# EAGLE design Heating Controller (EAGLE 6.4)
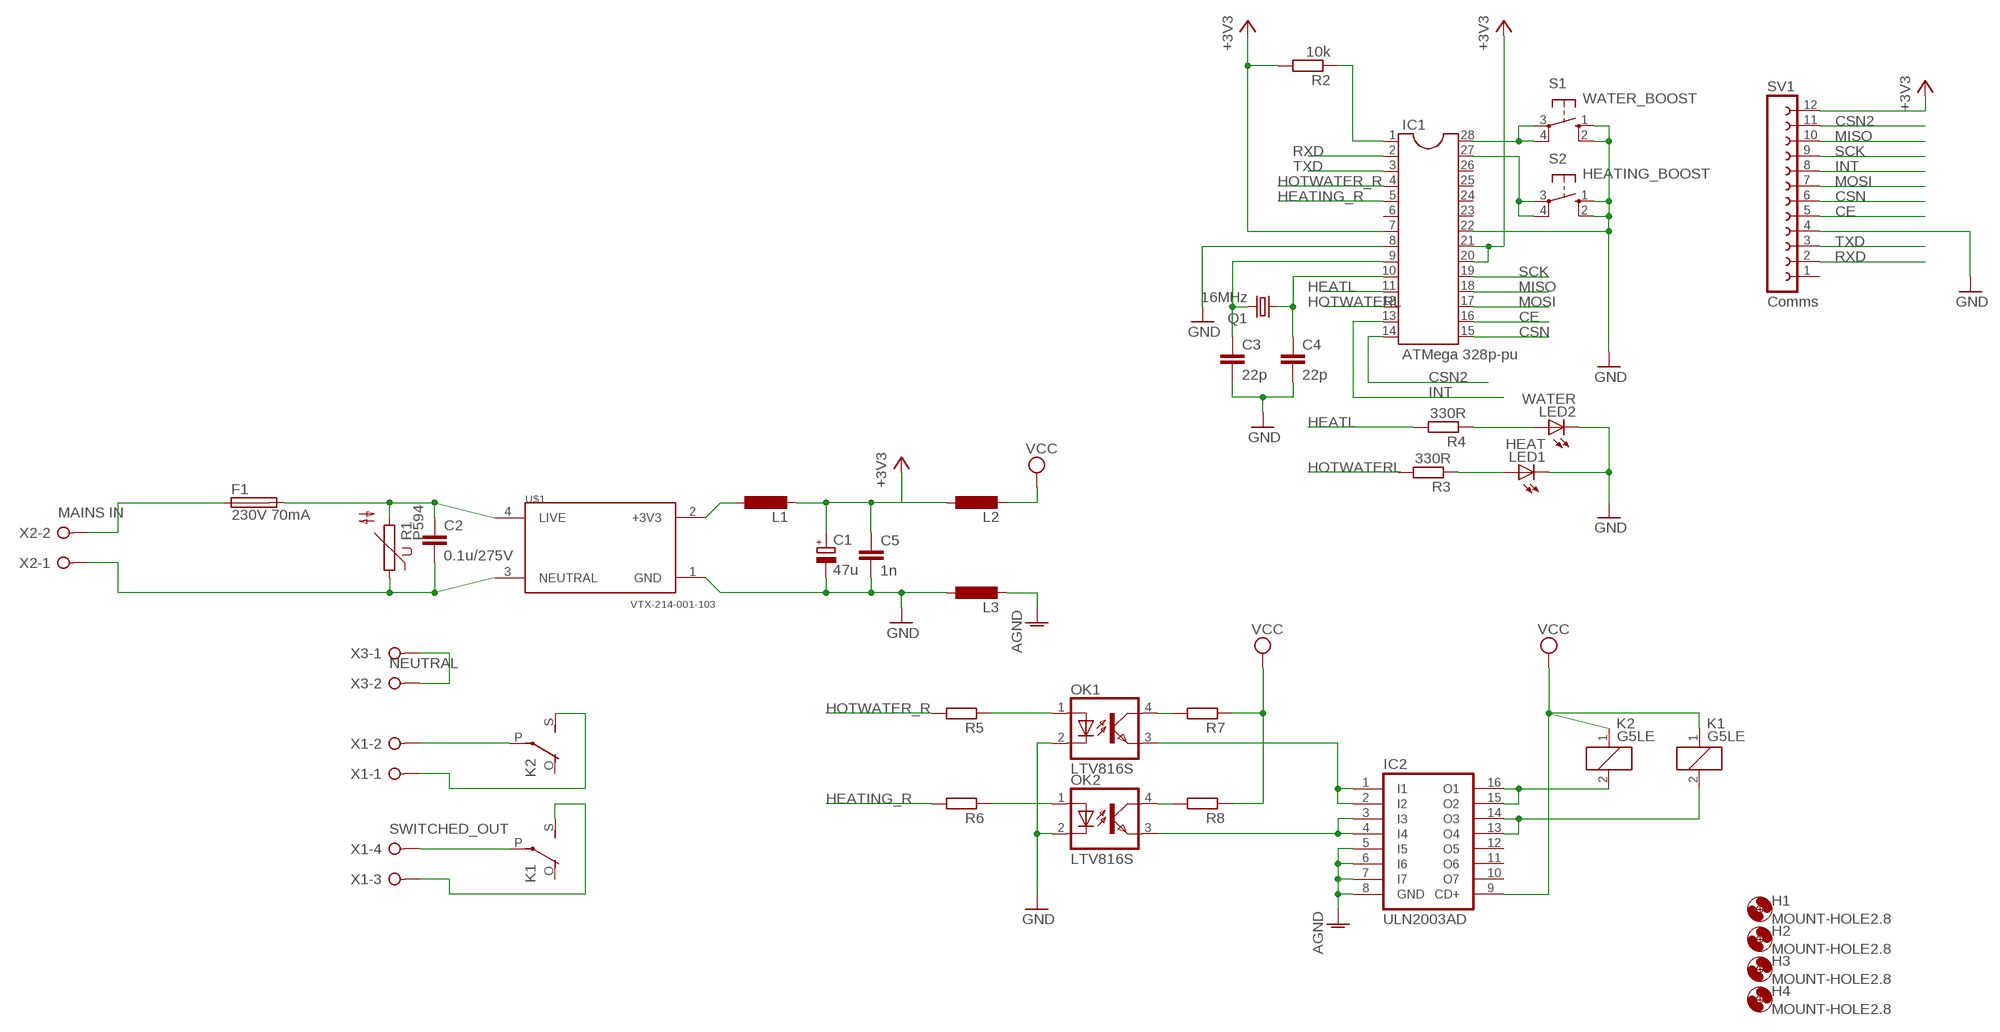
[diagram p0: schematic, sheet 1]

## Parts
C1  47u  CPOL-EUE2.5-7  [E2,5-7]
C2  0.1u/275V  C15/5  [C15B5]
C3  22p  C-EUC1206K  [C1206K]
C4  22p  C-EUC1206K  [C1206K]
C5  1n  C-EUC1206K  [C1206K]
F1  230V 70mA  SH22,5A  [SH22,5A]
H1  MOUNT-HOLE2.8  [2,8]
H2  MOUNT-HOLE2.8  [2,8]
H3  MOUNT-HOLE2.8  [2,8]
H4  MOUNT-HOLE2.8  [2,8]
IC1  ATMega 328p-pu  DIL28-3  [DIL28-3]
IC2  ULN2003AD  [SO16]
K1  G5LE  [G5LE]
K2  G5LE  [G5LE]
L1  L-EUL3230M  [L3230M]
L2  L-EUL3230M  [L3230M]
L3  L-EUL3230M  [L3230M]
LED1  HEAT  LED5MM  [LED5MM]
LED2  WATER  LED5MM  [LED5MM]
OK1  LTV816S  [SMD4]
OK2  LTV816S  [SMD4]
Q1  16MHz  CRYSTALHC49S  [HC49/S]
R1  P594  [P594]
R2  10k  R-EU_R1206  [R1206]
R3  330R  R-EU_R1206  [R1206]
R4  330R  R-EU_R1206  [R1206]
R5  R-EU_R1206  [R1206]
R6  R-EU_R1206  [R1206]
R7  R-EU_R1206  [R1206]
R8  R-EU_R1206  [R1206]
S1  WATER_BOOST  40-XX  [B3F-40XX]
S2  HEATING_BOOST  40-XX  [B3F-40XX]
SV1  Comms  FE12W  [FE12W]
U$1  VTX-214-001-103  [VTX214001103]
X1  SWITCHED_OUT  W237-04P  [W237-4P]
X2  MAINS IN  W237-02P  [W237-132]
X3  NEUTRAL  W237-02P  [W237-132]

## Nets
+3V3: C1.+ C5.1 IC1.7 IC1.20 IC1.21 L1.2 L2.1 R2.2 SV1.12
+3V3A: L1.1 U$1.2(+3V3)
AGND: IC2.5(I5) IC2.6(I6) IC2.7(I7) IC2.8(GND) L3.2
CE: IC1.16 SV1.5
CSN: IC1.15 SV1.6
CSN2: IC1.14 SV1.11
GND: C1.- C3.2 C4.2 C5.2 IC1.8 IC1.22 L3.1 LED1.K(C) LED2.K(C) OK1.2(C) OK2.2(C) S1.1(S) S1.2(S1) S2.1(S) S2.2(S1) SV1.4 U$1.1(GND)
HEATING_R: IC1.5 R6.2
HEATL: IC1.11 R4.2
HOTWATER_R: IC1.4 R5.2
HOTWATERL: IC1.12 R3.2
INT: IC1.13 SV1.8
MISO: IC1.18 SV1.10
MOSI: IC1.17 SV1.7
N$1: F1.1 X2.2
N$2: C2.1 F1.2 R1.2 U$1.4(LIVE)
N$3: C2.2 R1.1 U$1.3(NEUTRAL) X2.1
N$4: IC1.1 R2.1
N$5: C3.1 IC1.9 Q1.2
N$6: C4.1 IC1.10 Q1.1
N$7: LED1.A R3.1
N$8: LED2.A R4.1
N$9: IC1.28 S1.3(P) S1.4(P1)
N$10: IC1.27 S2.3(P) S2.4(P1)
N$11: OK1.1(A) R5.1
N$12: IC2.15(O2) IC2.16(O1) K2.2
N$13: IC2.13(O4) IC2.14(O3) K1.2
N$14: OK2.1(A) R6.1
N$15: K2.P(2:P) X1.2
N$16: K2.S(2:S) X1.1
N$17: K1.P(2:P) X1.4
N$18: K1.S(2:S) X1.3
N$19: X3.1 X3.2
N$20: OK1.4(COL) R7.2
N$21: OK2.4(COL) R8.2
N$22: IC2.1(I1) IC2.2(I2) OK1.3(EMIT)
N$23: IC2.3(I3) IC2.4(I4) OK2.3(EMIT)
RXD: IC1.2 SV1.2
SCK: IC1.19 SV1.9
TXD: IC1.3 SV1.3
VCC: IC2.9(CD+) K1.1 K2.1 L2.2 R7.1 R8.1
Unconnected: IC1.6 IC1.23 IC1.24 IC1.25 IC1.26 IC2.10(O7) IC2.11(O6) IC2.12(O5) K1.O(2:O) K2.O(2:O) SV1.1

## Library data of the parts
C1 = resistor:CPOL-EU: POLARIZED CAPACITOR, European symbol
C2 = capacitor-wima:C: CAPACITOR naming: grid - package width
C3-C5 = rcl:C-EU: CAPACITOR, European symbol
F1 = fuse:SH22,5A: FUSE HOLDER grid 22,5mm, isolated cap OGN0031 8201, Schurter (Buerklin); MPN: 0031.7701.11; OC_FARNELL: unknown; OC_NEWARK: 04F1224
H1-H4 = holes:MOUNT-HOLE: MOUNTING HOLE with drill center marker
IC1 = ic-package:DIL28: Dual In Line
IC2 = uln-udn:ULN2003A: DRIVER ARRAY
K1 K2 = relay:G5LE: RELAY 1 x switch, 10 A/120 V AC, 8 A/30 V DC, Omron; OC_FARNELL: unknown; OC_NEWARK: unknown
L1-L3 = rcl:L-EU: INDUCTOR, European symbol
LED1 LED2 = led:LED: LED OSRAM: - CHIPLED LG R971, LG N971, LY N971, LG Q971, LY Q971, LO R971, LY R971 LH N974, LH R974 LS Q976, LO Q976, LY Q976 LO Q996 - Hyper CHIPLED LW Q18S LB Q993, LB Q99A, LB R99A - SideLED LS A670, LO A670, LY A670, LG A670, LP A670 LB A673, LV A673, LT A673, LW A673 LH A674 LY A675 LS A676, LA A676, LO A676, LY A676, LW A676 LS A679, LY A679, LG A679 - Hyper Micro SIDELED® LS Y876, LA Y876, LO Y876, LY Y876 LT Y87S - SmartLED LW L88C, LW L88S LB L89C, LB L89S, LG L890 LS L89K, LO L89K, LY L89K LS L896, LA L896, LO L896, LY L896 - TOPLED LS T670, LO T670, LY T670, LG T670, LP T670 LSG T670, LSP T670, LSY T670, LOP T670, LYG T670 LG T671, LOG T671, LSG T671 LB T673, LV T673, LT T673, LW T673 LH T674 LS T676, LA T676, LO T676, LY T676, LB T676, LH T676, LSB T676, LW T676 LB T67C, LV T67C, LT T67C, LS T67K, LO T67K, LY T67K, LW E67C LS E67B, LA E67B, LO E67B, LY E67B, LB E67C, LV E67C, LT E67C LW T67C LS T679, LY T679, LG T679 LS T770, LO T770, LY T770, LG T770, LP T770 LB T773, LV T773, LT T773, LW T773 LH T774 LS E675, LA E675, LY E675, LS T675 LS T776, LA T776, LO T776, LY T776, LB T776 LHGB T686 LT T68C, LB T68C - Hyper Mini TOPLED® LB M676 - Mini TOPLED Santana® LG M470 LS M47K, LO M47K, LY M47K Source: http://www.osram.convergy.de LUXEON: - LUMILED® LXK2-PW12-R00, LXK2-PW12-S00, LXK2-PW14-U00, LXK2-PW14-V00 LXK2-PM12-R00, LXK2-PM12-S00, LXK2-PM14-U00 LXK2-PE12-Q00, LXK2-PE12-R00, LXK2-PE12-S00, LXK2-PE14-T00, LXK2-PE14-U00 LXK2-PB12-K00, LXK2-PB12-L00, LXK2-PB12-M00, LXK2-PB14-N00, LXK2-PB14-P00, LXK2-PB14-Q00 LXK2-PR12-L00, LXK2-PR12-M00, LXK2-PR14-Q00, LXK2-PR14-R00 LXK2-PD12-Q00, LXK2-PD12-R00, LXK2-PD12-S00 LXK2-PH12-R00, LXK2-PH12-S00 LXK2-PL12-P00, LXK2-PL12-Q00, LXK2-PL12-R00 Source: www.luxeon.com KINGBRIGHT: KA-3528ASYC Source: www.kingbright.com
OK1 OK2 = optocoupler:LTV816: OPTO COUPLER Source: LITEON, LTV816.pdf; OC_FARNELL: unknown; OC_NEWARK: unknown
Q1 = crystal:CRYSTAL: CRYSTAL; OC_FARNELL: 1667008; OC_NEWARK: unknown
R1 = varistor:P594: VARISTOR
R2-R8 = rcl:R-EU_: RESISTOR, European symbol
S1 S2 = switch-omron:40-XX: OMRON SWITCH; MF: OMRON COMPONENTS USA; MPN: B3F-4000; OC_FARNELL: 176434; OC_NEWARK: 36K3105
SV1 = con-lsta:FE12W: FEMALE HEADER; OC_FARNELL: unknown; OC_NEWARK: unknown
U$1 = VTX214001103:VTX-214-001-103
X1 = con-wago-508:W237-04P: WAGO SREW CLAMP; OC_FARNELL: unknown; OC_NEWARK: unknown
X2 X3 = con-wago-508:W237-02P: WAGO SREW CLAMP; OC_FARNELL: unknown; OC_NEWARK: unknown

## Board
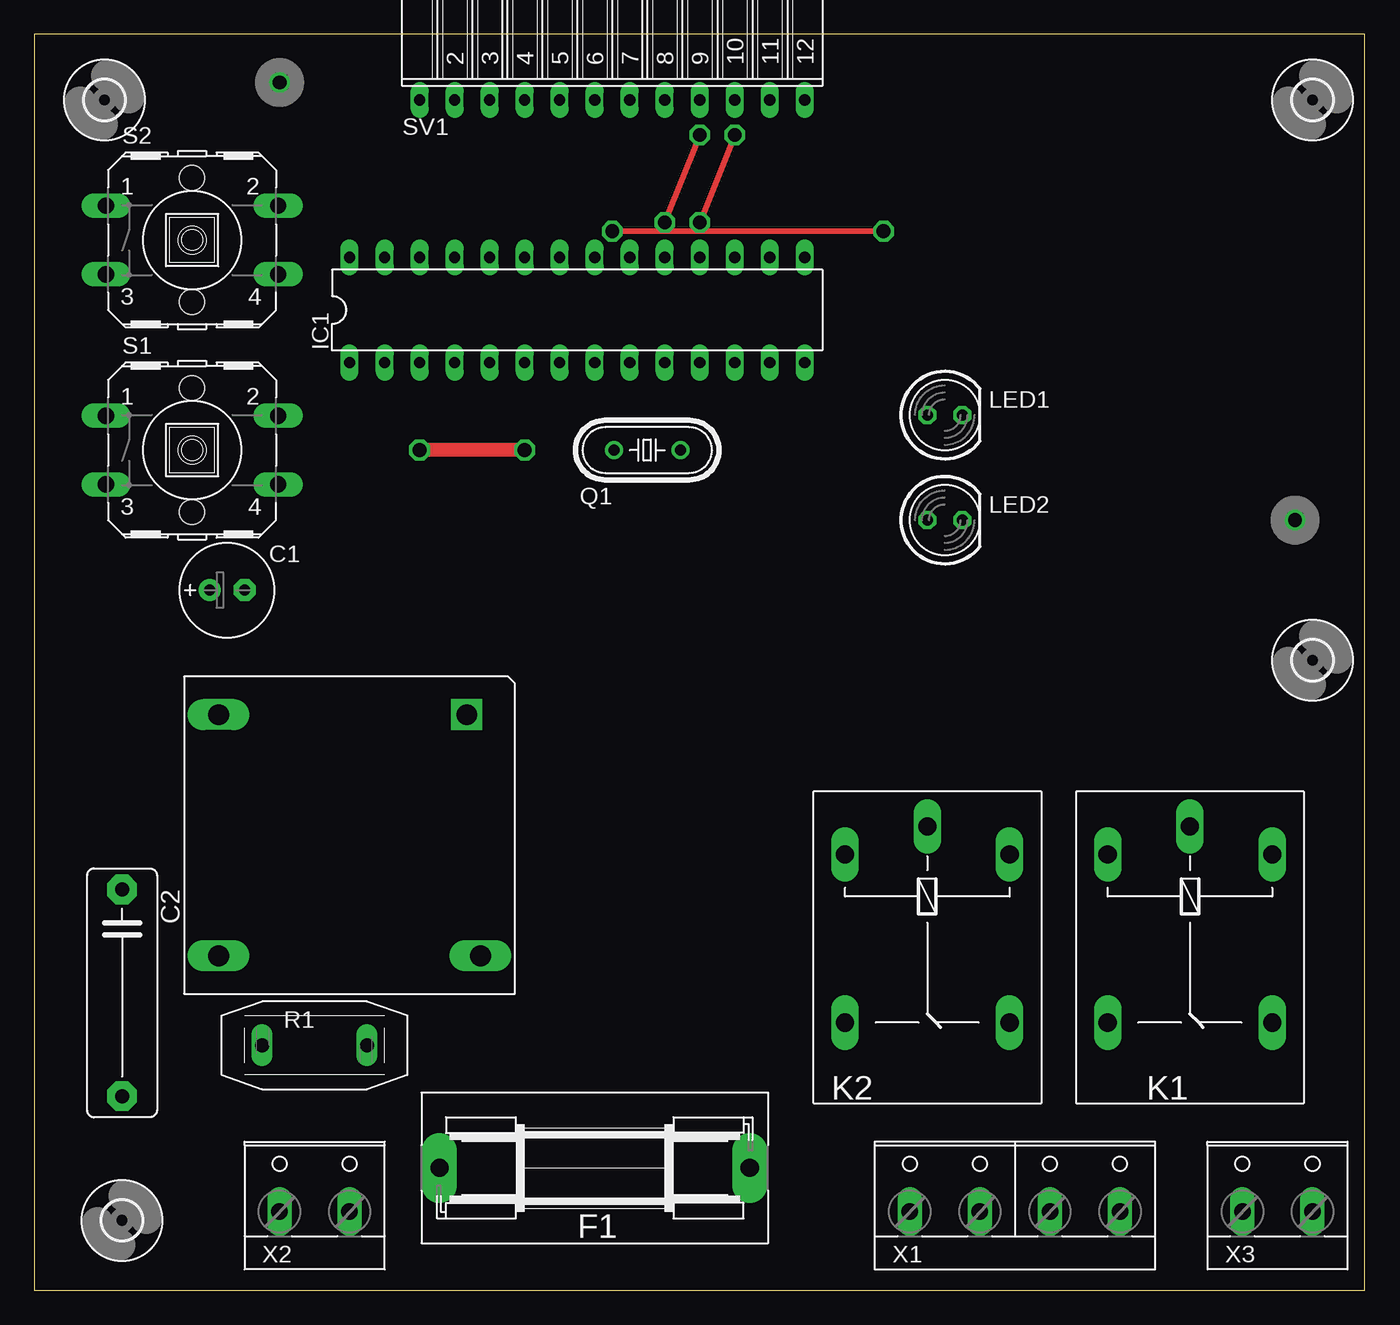
[diagram p1: board, top side]
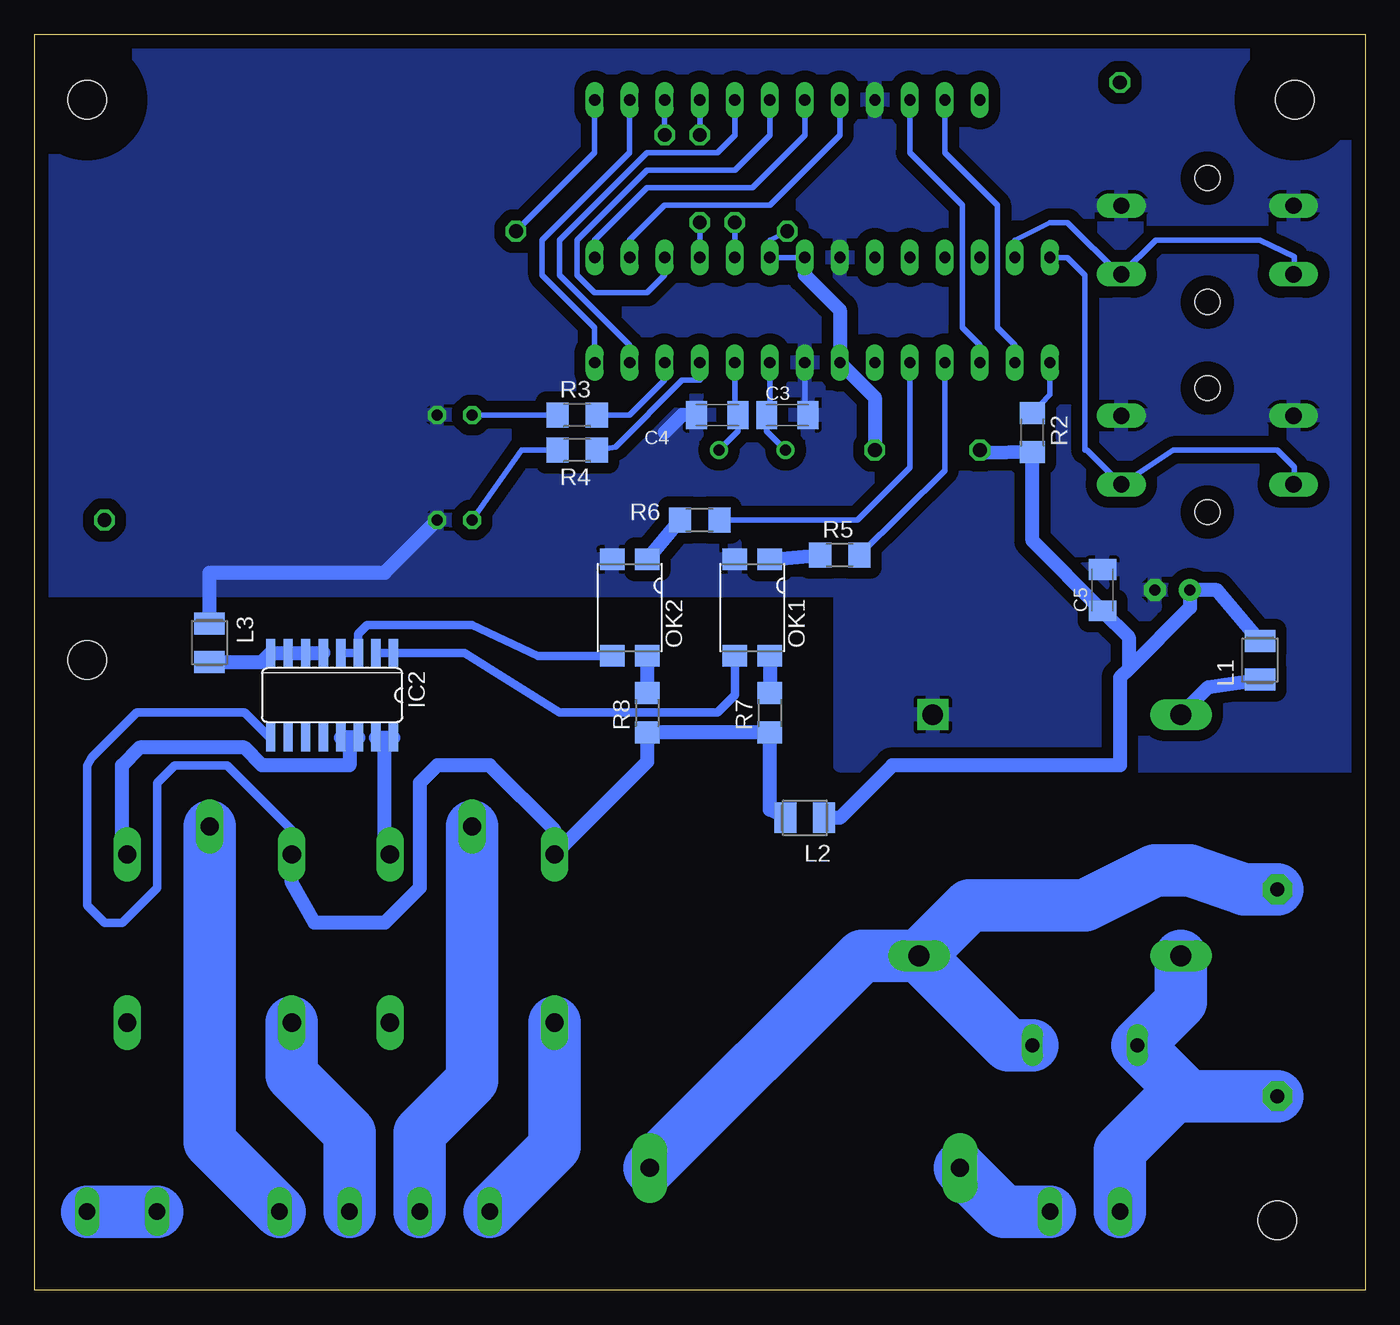
[diagram p2: board, bottom side, seen from below]

Size 96.5 x 91.11 mm. Coordinates in mm from the lower left corner, seen from the top.
Outline: 0,0 96.5,0 96.5,91.11 0,91.11 0,0
Copper layers (1*16): Top 0.035mm / dielectric 1.5mm / Bottom 0.035mm
Design rules "default": minimum track width 10mil, minimum drill 24mil, track to track 8mil, track to pad 8mil, pad to pad 8mil, via to via 8mil, smd to smd 8mil, copper to edge 40mil, drill to drill 8mil, minimum pad ring 10mil, minimum via ring 8mil, stop-mask expansion 4mil, vias tented up to drill 0mil, thermal gap 10mil

### Footprints (pad centres in the part's own frame; a part is rotated, then mirrored left to right if it is on the bottom)
E2,5-7 = drill 0.813 pad 1.6: + -1.27,0 | drill 0.813 pad 1.6 octagon: - 1.27,0
C15B5 = drill 1.016 pad 2.159 octagon: 1 -7.493,0; 2 7.493,0
C1206K = smd 1.5 x 2: 1 -1.5,0; 2 1.5,0
SH22,5A = drill 1.321 pad 2.54 long: 1 -11.252,0; 2 11.252,0
2,8 = hole 2.8: 0,0
DIL28-3 = drill 0.813 long: 1 -16.51,-3.81; 2 -13.97,-3.81; 3 -11.43,-3.81; 4 -8.89,-3.81; 5 -6.35,-3.81; 6 -3.81,-3.81; 7 -1.27,-3.81; 8 1.27,-3.81; 9 3.81,-3.81; 10 6.35,-3.81; 11 8.89,-3.81; 12 11.43,-3.81; 13 13.97,-3.81; 14 16.51,-3.81; 15 16.51,3.81; 16 13.97,3.81; 17 11.43,3.81; 18 8.89,3.81; 19 6.35,3.81; 20 3.81,3.81; 21 1.27,3.81; 22 -1.27,3.81; 23 -3.81,3.81; 24 -6.35,3.81; 25 -8.89,3.81; 26 -11.43,3.81; 27 -13.97,3.81; 28 -16.51,3.81
SO16 = smd 0.66 x 2.032: 1 -4.445,-3.073; 2 -3.175,-3.073; 3 -1.905,-3.073; 4 -0.635,-3.073; 5 0.635,-3.073; 6 1.905,-3.073; 7 3.175,-3.073; 8 4.445,-3.073; 9 4.445,3.073; 10 3.175,3.073; 11 1.905,3.073; 12 0.635,3.073; 13 -0.635,3.073; 14 -1.905,3.073; 15 -3.175,3.073; 16 -4.445,3.073
G5LE = drill 1.321 long: 1 -7.493,-5.969; 2 -7.493,5.969; O 4.699,5.969; P -9.525,0; S 4.699,-5.969
L3230M = smd 1.6 x 2.2: 1 -1.4,0; 2 1.4,0
LED5MM = drill 0.813 octagon: A -1.27,0; K 1.27,0
SMD4 = smd 1.78 x 1.55: 1 -1.27,-3.5; 2 1.27,-3.5; 3 1.27,3.5; 4 -1.27,3.5
HC49/S = drill 0.813: 1 -2.413,0; 2 2.413,0
P594 = drill 1.016 long: 1 0,3.81; 2 0,-3.81
R1206 = smd 1.6 x 1.803: 1 -1.422,0; 2 1.422,0
B3F-40XX = drill 1.194 long: 1 -6.248,2.489; 2 6.248,2.489; 3 -6.248,-2.489; 4 6.248,-2.489 | hole 1.803: 0,-4.496; 0,4.496
FE12W = drill 0.813 long: 1 -13.97,0; 2 -11.43,0; 3 -8.89,0; 4 -6.35,0; 5 -3.81,0; 6 -1.27,0; 7 1.27,0; 8 3.81,0; 9 6.35,0; 10 8.89,0; 11 11.43,0; 12 13.97,0
VTX214001103 = drill 1.5 square: 1 8.75,-8.5 | drill 1.5 long: 2 8.75,9.5; 3 -8.75,9.5; 4 -8.75,-9.5
W237-4P = drill 1.194 long: 1 -7.62,-0.635; 2 -2.54,-0.635; 3 2.54,-0.635; 4 7.62,-0.635
W237-132 = drill 1.194 long: 1 -2.54,-0.635; 2 2.54,-0.635

### Placement (x,y rotation side)
C1  13.97,50.8 0 top
C2  6.35,21.59 270 top
C3  41.91,63.5 0 bottom
C4  46.99,63.5 180 bottom
C5  19.05,50.8 90 bottom
F1  40.64,8.89 0 top
H1  5.08,86.36 0 top
H2  6.35,5.08 0 top
H3  92.71,45.72 0 top
H4  92.71,86.36 0 top
IC1  39.37,71.12 0 top
IC2  74.93,43.18 180 bottom
K1  83.82,24.13 270 top
K2  64.77,24.13 270 top
L1  7.62,45.72 90 bottom
L2  40.64,34.29 180 bottom
L3  83.82,46.99 270 bottom
LED1  66.04,63.5 0 top
LED2  66.04,55.88 0 top
OK1  44.45,49.53 180 bottom
OK2  53.34,49.53 180 bottom
Q1  44.45,60.96 180 top
R1  20.32,17.78 90 top
R2  24.13,62.23 270 bottom
R3  57.15,63.5 0 bottom
R4  57.15,60.96 0 bottom
R5  38.1,53.34 0 bottom
R6  48.26,55.88 0 bottom
R7  43.18,41.91 90 bottom
R8  52.07,41.91 90 bottom
S1  11.43,60.96 0 top
S2  11.43,76.2 0 top
SV1  41.91,86.36 0 top
U$1  22.86,33.02 90 top
X1  71.12,6.35 0 top
X2  20.32,6.35 0 top
X3  90.17,6.35 0 top

### Tracks (layer width: path | path; a pad name or v marks a point on that pad's centre or on a via)
+3V3  (via drill 1)
  Top 0.406: v41.91,76.83 v61.59,76.83
  Top 1.016: v35.56,60.96 v27.94,60.96
  Bottom 0.406: IC1.21 IC1.20 43.18,76.2 v41.91,76.83 | IC1.7 38.1,68.58 | SV1.12 55.88,82.55 v61.59,76.83
  Bottom 1.016: L2.1 38.1,34.29 34.29,38.1 17.78,38.1 17.78,44.45 17.14,45.09 | L1.2 10.75,50.8 C1.+ 12.7,49.53 17.14,45.09 | 17.14,45.09 17.14,47.4 C5.1 24.13,54.38 R2.2 27.71,60.73 v27.94,60.96 | IC1.21 40.64,73.66 38.1,71.12 IC1.7 35.56,64.77 v35.56,60.96
+3V3A
  Bottom 1.016: U$1.2 11.36,43.77 L1.1
AGND
  Bottom 1.016: IC2.5 IC2.6 IC2.7 IC2.8 80.04,45.59 L3.2
CE
  Bottom 0.406: IC1.16 53.34,76.2 50.8,78.74 43.18,78.74 38.1,83.82 SV1.5
CSN
  Bottom 0.406: IC1.15 55.88,76.2 52.07,80.01 44.45,80.01 40.64,83.82 SV1.6
CSN2
  Bottom 0.406: IC1.14 55.88,69.85 59.69,73.66 59.69,76.2 53.34,82.55 SV1.11
GND
  Bottom 0.406: IC1.8 40.64,63.73 C3.2
  Bottom 1.016: C4.2 49.53,63.5 50.8,62.23 | L3.1 83.82,52.07 71.12,52.07 LED2.K
  pour Bottom (isolate 0.813): 0,101.6 104.14,101.6 104.14,50.8 38.1,50.8 38.1,38.1 0,38.1
HEATING_R
  Bottom 0.406: IC1.5 33.02,59.69 36.83,55.88 R6.2
HEATL
  Bottom 0.406: IC1.11 48.26,66.04 49.53,66.04 54.38,61.19 R4.2
HOTWATER_R
  Bottom 0.406: IC1.4 30.48,59.46 R5.2
HOTWATERL
  Bottom 0.406: IC1.12 50.8,66.04 53.34,63.5 R3.2
INT
  Bottom 0.406: IC1.13 53.34,68.58 58.42,73.66 58.42,76.2 52.07,82.55 46.99,82.55 45.72,83.82 SV1.8
MISO  (via drill 1)
  Top 0.406: v50.8,83.82 v48.26,77.47
  Bottom 0.406: IC1.18 v48.26,77.47 | SV1.10 v50.8,83.82
MOSI
  Bottom 0.406: IC1.17 50.8,73.66 52.07,72.39 55.88,72.39 57.15,73.66 57.15,76.2 52.07,81.28 45.72,81.28 43.18,83.82 SV1.7
N$1
  Bottom 3.81: X2.2 26.21,5.71 F1.1
N$2
  Bottom 3.81: R1.2 25.87,17.78 U$1.4 | U$1.4 36.51,24.27 F1.2 | C2.1 8.76,29.08 12.7,30.48 15.24,30.48 20.32,27.94 28.69,27.94 U$1.4
N$3
  Bottom 3.81: C2.2 12.83,14.1 13.97,15.24 | 13.97,15.24 R1.1 13.36,20.93 U$1.3 | X2.1 17.78,10.16 13.97,13.97 13.97,15.24
N$4
  Bottom 0.406: IC1.1 22.86,65 R2.1
N$5
  Bottom 0.406: IC1.9 43.18,63.73 C3.1 43.41,62.33 Q1.2
N$6
  Bottom 0.406: IC1.10 45.72,63.73 C4.1 45.49,62.33 Q1.1
N$7
  Bottom 0.406: R3.1 LED1.A
N$8
  Bottom 0.406: R4.1 61.19,60.96 LED2.A
N$9
  Bottom 0.406: S1.3 5.13,59.74 6.35,60.96 13.92,60.96 S1.4 20.17,60.96 20.32,60.96 20.32,73.66 21.59,74.93 IC1.28
N$10
  Bottom 0.406: S2.3 5.13,74.98 7.62,76.2 15.19,76.2 S2.4 17.83,73.71 21.59,77.47 22.86,77.47 25.4,76.2 IC1.27
N$11
  Bottom 1.016: OK1.1 R5.1
N$12
  Bottom 1.016: K2.2 71.12,32 71.12,40.11 | IC2.15 71.12,40.11 | 71.12,40.11 IC2.16
N$13
  Bottom 1.016: K1.2 90.17,32 90.17,38.1 88.9,39.37 81.28,39.37 80.01,38.1 73.66,38.1 73.66,40.11 IC2.13 IC2.14
N$14
  Bottom 1.016: R6.1 OK2.1
N$15
  Bottom 3.81: K2.P 64.77,15.24 68.58,11.43 X1.2
N$16
  Bottom 3.81: K2.S 58.8,10.41 X1.1
N$17
  Bottom 3.81: K1.P 83.82,10.79 X1.4
N$18
  Bottom 3.81: K1.S 77.85,15.62 73.66,11.43 X1.3
N$19
  Bottom 3.81: X3.1 X3.2
N$20
  Bottom 1.016: OK1.4 R7.2
N$21
  Bottom 1.016: OK2.4 R8.2
N$22
  Bottom 0.61: IC2.2 IC2.1 65.3,46.25 58.42,41.91 46.99,41.91 45.72,43.18 OK1.3
N$23
  Bottom 0.61: IC2.4 IC2.3 73.03,47.62 72.39,48.26 64.77,48.26 60,46.03 OK2.3
N$24  (via drill 1)
  other vias: 17.78,87.63
N$25  (via drill 1)
  other vias: 91.44,55.88
RXD
  Bottom 0.406: SV1.2 30.48,82.55 26.67,78.74 26.67,69.85 25.4,68.58 IC1.2
SCK  (via drill 1)
  Top 0.406: v48.26,83.82 v45.72,77.47
  Bottom 0.406: IC1.19 v45.72,77.47 | SV1.9 v48.26,83.82
TXD
  Bottom 0.406: SV1.3 33.02,82.55 29.21,78.74 29.21,69.85 27.94,68.58 IC1.3
VCC
  Bottom 0.61: K1.1 77.85,33.4 82.55,38.1 86.36,38.1 87.63,36.83 87.63,29.21 90.17,26.67 91.44,26.67 92.71,27.94 92.71,38.1 92.36,38.67 89.12,41.91 81.28,41.91 79.48,40.11 IC2.9
  Bottom 1.016: K1.1 77.85,29.59 76.2,26.67 71.12,26.67 68.58,29.21 68.58,36.83 67.31,38.1 63.5,38.1 58.8,33.4 K2.1 52.07,38.35 R8.1 R7.1 43.18,34.88 L2.2

### Text on the board
tDocu: SmartHome | Rev A. | 2015 | Heating Controller | MAINS | S/O1 | S/O2 | Neutral | N | L